# EAGLE design raspiPowerControl (EAGLE 9.6.2)

## Sheet 1 of 2: Raspberry Pi Power Switch with 5V micro USB socket
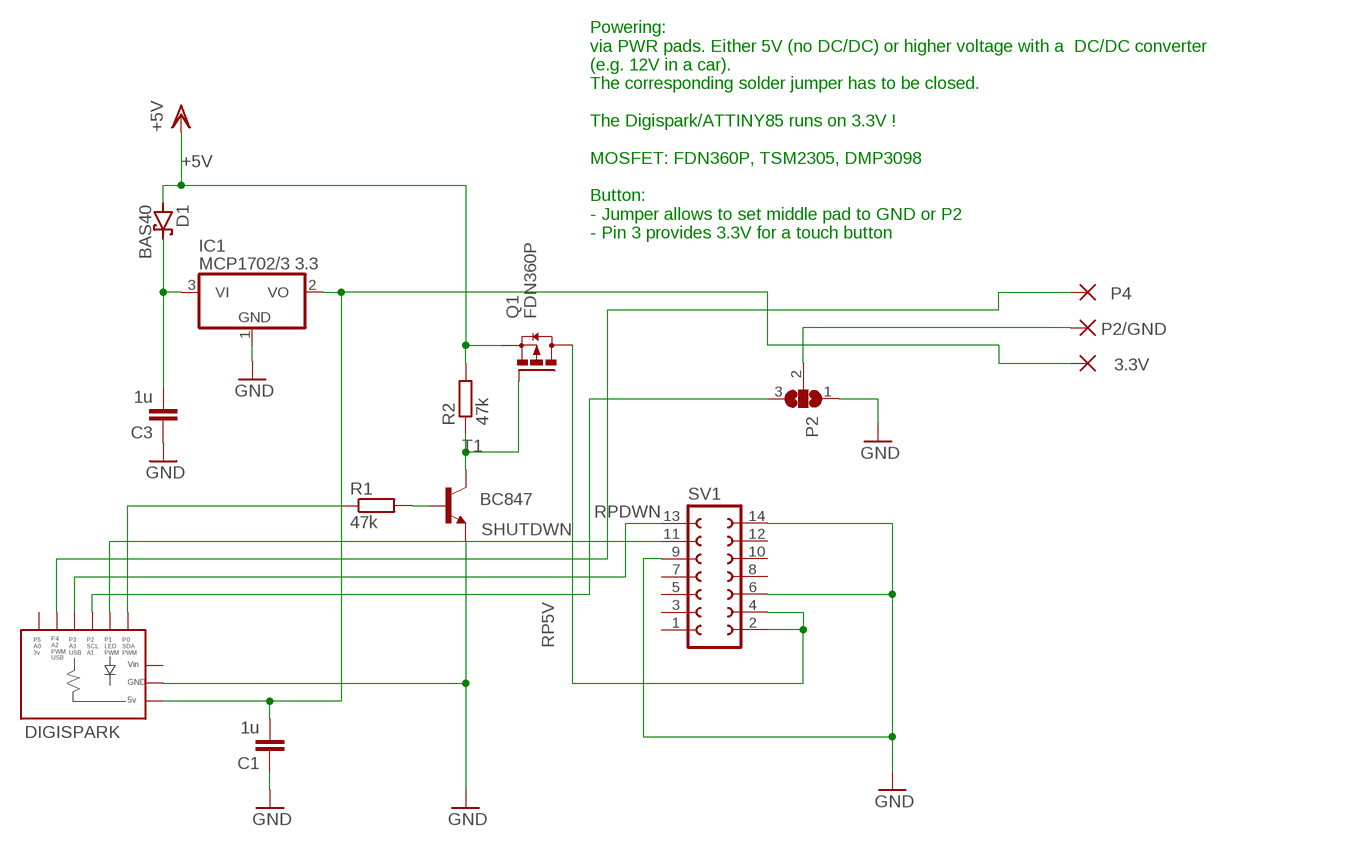
[diagram p0: schematic, sheet 1]

### Parts
3.3V  WIREPADSMD5-1,8  [5-1,8]
C1  1u  C-EUC0805  [C0805]
C3  1u  C-EUC0805  [C0805]
D1  BAS40  [SOT23]
DIGISPARK  DIGISPARKDIGISPARK-SMD  [DIGISPARK-SMD]
IC1  MCP1702/3 3.3  MCP1703CB  [SOT23]
P2  SJ2W  [SJ_2]
P2/GND  WIREPADSMD5-1,8  [5-1,8]
P4  WIREPADSMD5-1,8  [5-1,8]
Q1  FDN360P  [SUPER-SOT3]
R1  47k  R-EU_M0805  [M0805]
R2  47k  R-EU_M0805  [M0805]
SV1  FE07-2  [FE07-2]
T1  BC847  [SOT23]

### Nets
3V3: 3.3V.1(P) C1.2 DIGISPARK.5V IC1.2(VO)
+5V: D1.1(A) Q1.2(S) R2.2 ; also sheet 2
BUT2: P2.2 P2/GND.1(P)
BUT4: DIGISPARK.P4 P4.1(P)
GND: C1.1 C3.1 DIGISPARK.GND IC1.1(GND) P2.1 SV1.6 SV1.9 SV1.14 T1.2(E) ; also sheet 2
N$1: C3.2 D1.3(C) IC1.3(VI)
N$3: Q1.1(G) R2.1 T1.3(C)
N$4: R1.2 T1.1(B)
P2: DIGISPARK.P2 P2.3
RP5V: Q1.3(D) SV1.2 SV1.4
RPDWN: DIGISPARK.P3 SV1.13
SHUTDWN: DIGISPARK.P1 SV1.11
SWPWR: DIGISPARK.P0 R1.1
Unconnected: DIGISPARK.P5 SV1.1 SV1.3 SV1.5 SV1.7 SV1.8 SV1.10 SV1.12

### Notes on the sheet
- Powering:
  via PWR pads. Either 5V (no DC/DC) or higher voltage with a  DC/DC converter
  (e.g. 12V in a car). 
  The corresponding solder jumper has to be closed.
  
  The Digispark/ATTINY85 runs on 3.3V !
  
  MOSFET: FDN360P, TSM2305, DMP3098
  
  Button:
  - Jumper allows to set middle pad to GND or P2
  - Pin 3 provides 3.3V for a touch button

## Sheet 2 of 2: Addition for 12V car battery powering
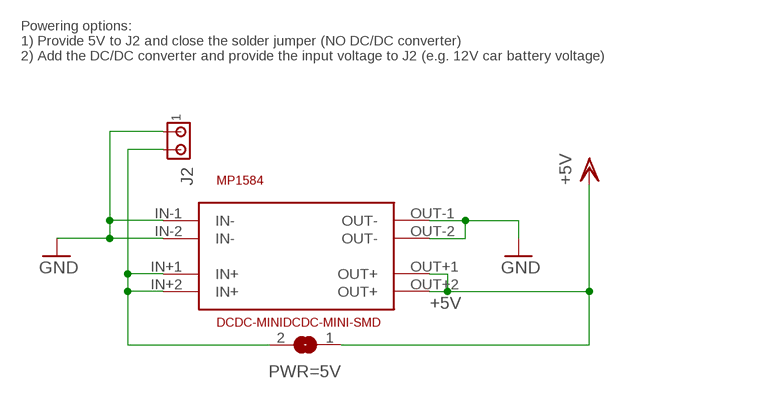
[diagram p1: schematic, sheet 2]

### Parts
J2  MTA02-100  [10X02MTA]
MP1584  DCDC-MINIDCDC-MINI-SMD  [DCDC-MINI-SMD]
PWR=5V  SJ  [SJ]

### Nets
+5V: MP1584.OUT+1(OUT+) MP1584.OUT+2(OUT+) PWR=5V.1 ; also sheet 1
GND: J2.1 MP1584.IN-1(IN-) MP1584.IN-2(IN-) MP1584.OUT-1(OUT-) MP1584.OUT-2(OUT-) ; also sheet 1
PWR: J2.2 MP1584.IN+1(IN+) MP1584.IN+2(IN+) PWR=5V.2

### Notes on the sheet
- Powering options:
  1) Provide 5V to J2 and close the solder jumper (NO DC/DC converter)
  2) Add the DC/DC converter and provide the input voltage to J2 (e.g. 12V car battery voltage)

## Power pins joined to a net without a drawn wire
VIN: DIGISPARK.VIN

## Library data of the parts
3.3V P2/GND P4 = wirepad:WIREPAD: Wire PAD connect wire on PCB
C1 C3 = rcl:C-EU: CAPACITOR, European symbol; SPICEPREFIX: C
D1 = diode:BAS40: Silicon Schottky Diodes General-purpose diode for high-speed switching
DIGISPARK = raspiPowerControl:DIGISPARK: Digispark http://digistump.com/wiki/digispark
IC1 = linear:MCP1703: 250 mA, 16V, Low Quiescent Current LDO Regulator Source: http://ww1.microchip.com/downloads/en/DeviceDoc/22049b.pdf
J2 = con-amp:MTA02-100: AMP connector
MP1584 = raspiPowerControl:DCDC-MINI: DC/DC Step-Down Converter 0.8-20V
P2 = jumper:SJ2W: SMD solder JUMPER
PWR=5V = jumper:SJ: SMD solder JUMPER
Q1 = transistor-power:FDN360P: Single P-Channel, PowerTrench (R) MOSFET Source: http://www.fairchildsemi.com/ds/FD/FDN360P.pdf
R1 R2 = rcl:R-EU_: RESISTOR, European symbol; SPICEPREFIX: R
SV1 = con-lsta:FE07-2: FEMALE HEADER; OC_FARNELL: unknown; OC_NEWARK: unknown
T1 = transistor-neu-to92:BC847: NPN TRANSISTOR

## Board
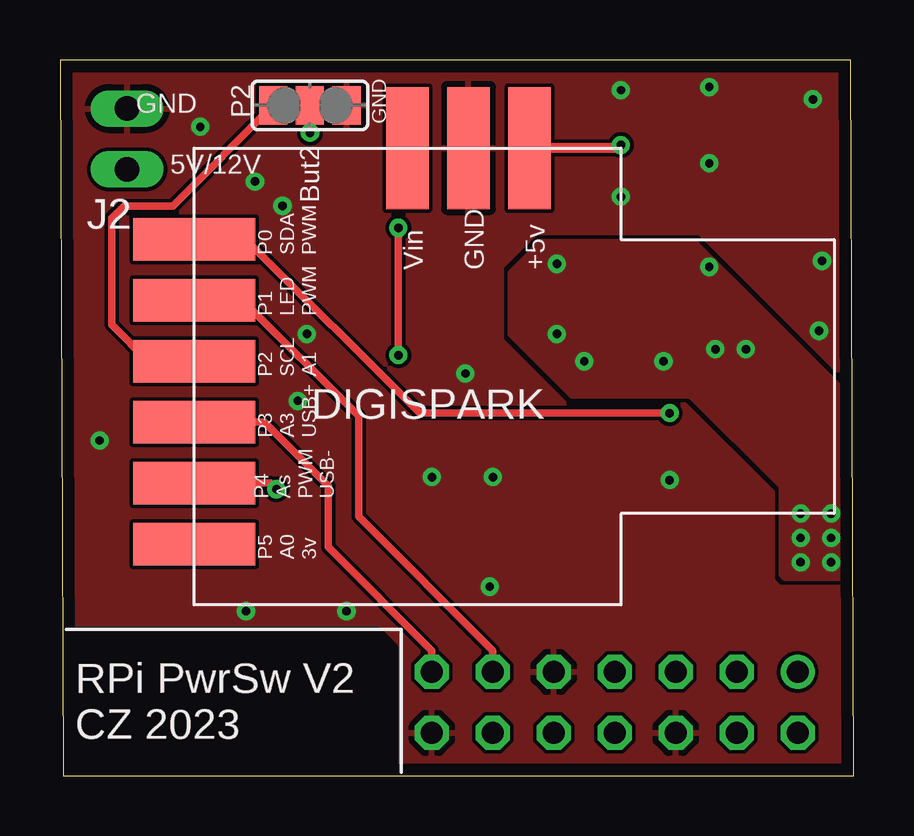
[diagram p2: board, top side]
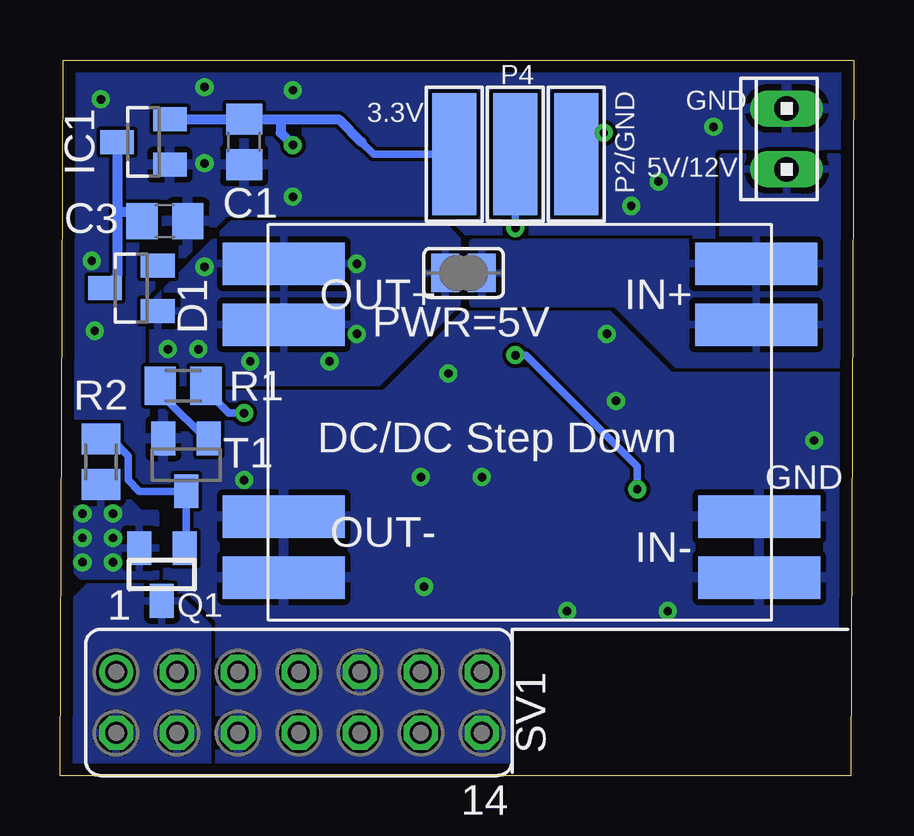
[diagram p3: board, bottom side, seen from below]

Size 33.07 x 29.84 mm. Coordinates in mm from the lower left corner, seen from the top.
Outline: 0.13,0 33.07,0 32.94,29.84 0,29.84 0.13,0
Copper layers (1*16): Top 0.035mm / dielectric 1.5mm / Bottom 0.035mm
Design rules "default *": minimum track width 6mil, minimum drill 0.35mm, track to track 6mil, track to pad 6mil, pad to pad 6mil, via to via 6mil, smd to smd 6mil, copper to edge 20mil, drill to drill 6mil, minimum pad ring 10mil, minimum via ring 8mil, stop-mask expansion 4mil, vias tented up to drill 0mil, thermal gap 10mil

### Footprints (pad centres in the part's own frame; a part is rotated, then mirrored left to right if it is on the bottom)
5-1,8 = smd 1.829 x 5.08: 1 0,0
C0805 = smd 1.3 x 1.5: 1 -0.95,0; 2 0.95,0
SOT23 = smd 1 x 1.4: 1 -0.95,-1.1; 2 0.95,-1.1; 3 0,1.1
DIGISPARK-SMD = smd 5.08 x 1.778: 5V 19.05,3.81; GND 19.05,6.35; VIN 19.05,8.89 | smd 1.778 x 5.08: P0 15.24,17.78; P1 12.7,17.78; P2 10.16,17.78; P3 7.62,17.78; P4 5.08,17.78; P5 2.54,17.78
10X02MTA = drill 1.016 long: 1 1.27,0; 2 -1.27,0
DCDC-MINI-SMD = smd 5.08 x 1.778: IN+1 -9.525,-7.239; IN+2 -9.525,-9.779; IN-1 -9.652,3.302; IN-2 -9.652,0.762; OUT+1 10.16,-7.239; OUT+2 10.16,-9.779; OUT-1 10.16,3.302; OUT-2 10.16,0.762
SJ_2 = smd 1.168 x 1.6: 1 -1.524,0; 2 0,0; 3 1.524,0
SJ = smd 1.168 x 1.6: 1 -0.762,0; 2 0.762,0
SUPER-SOT3 = smd 1 x 1.4: 1 -0.95,-1.1; 2 0.95,-1.1; 3 0,1.1
M0805 = smd 1.3 x 1.6: 1 -0.95,0; 2 0.95,0
FE07-2 = drill 0.914: 1 -7.62,1.27 | drill 0.914 octagon: 2 -7.62,-1.27; 3 -5.08,1.27; 4 -5.08,-1.27; 5 -2.54,1.27; 6 -2.54,-1.27; 7 0,1.27; 8 0,-1.27; 9 2.54,1.27; 10 2.54,-1.27; 11 5.08,1.27; 12 5.08,-1.27; 13 7.62,1.27; 14 7.62,-1.27

### Placement (x,y rotation side)
3.3V  16.64,25.91 0 bottom
C1  25.4,26.42 90 bottom
C3  28.7,23.11 180 bottom
D1  30.1,20.32 90 bottom
DIGISPARK  23.37,7.11 90 top
IC1  29.59,26.42 90 bottom
J2  2.79,26.54 90 bottom
MP1584  13.59,11.56 180 bottom
P2  10.41,27.94 180 top
P2/GND  11.56,25.91 0 bottom
P4  14.1,25.91 0 bottom
PWR=5V  16.26,20.95 0 bottom
Q1  28.83,8.38 180 bottom
R1  27.94,16.26 180 bottom
R2  31.37,13.08 270 bottom
SV1  23.11,3.05 0 bottom
T1  27.81,12.95 180 bottom

### Tracks (layer width: path | path; a pad name or v marks a point on that pad's centre or on a via)
3V3  (via drill 0.35)
  Top 0.406: v23.37,26.29 23.24,26.16 DIGISPARK.5V
  Bottom 0.305: 20.51,26.41 20,25.91 3.3V.1
  Bottom 0.406: IC1.2 C1.2 23.88,27.37 | 23.88,27.37 21.46,27.37 20.51,26.41 | 23.88,27.37 23.88,26.8 v23.37,26.29
+5V  (via drill 0.35)
  other vias: 27.05,21.21 28.57,17.78 27.3,17.78 21.84,17.27 25.15,17.27 20.7,18.41 20.7,21.34 30.86,10.92 32.13,10.92 32.13,9.91 32.13,8.89 30.86,8.89 30.86,9.91
  pour Bottom (rank 2): 16.51,22.35 16.51,19.68 19.81,16.38 29.21,16.38 29.21,19.68 25.91,22.99 17.14,22.99
  pour Top: 18.8,20.95 18.8,18.41 21.34,15.88 26.29,15.88 30.1,12.06 30.1,8.38 30.23,8.26 32.64,8.26 32.77,8.38 32.77,15.88 26.42,22.23 20.07,22.23
  pour Bottom (rank 2): 29.08,10.92 29.08,8.26 32.13,8.26 32.89,9.02 32.89,11.05 31.5,12.45 31.24,12.45 29.72,10.92
BUT2  (via drill 0.35)
  Top 0.305: P2.2 v10.41,26.8
  Bottom 0.305: v10.41,26.8 10.67,26.8 P2/GND.1
BUT4  (via drill 0.35)
  Top 0.305: DIGISPARK.P4 8.76,12.19 v9.02,11.94 | v14.1,17.53 v14.1,22.84
  Bottom 0.305: v14.1,17.53 13.67,17.53 9.02,12.88 v9.02,11.94 | v14.1,22.84 P4.1
GND  (via drill 0.35)
  other vias: 23.37,24.13 31.37,28.19 31.75,21.46 11.94,6.86 7.75,6.86 1.65,13.97 15.49,12.45 16.89,16.76 5.84,27.05 8.13,24.77 9.27,23.75 17.91,7.87 10.29,18.41 9.91,15.62 27.05,25.53 27.05,28.7 23.37,28.57 25.4,12.32 31.62,18.54 18.03,12.45
  pour Top (rank 3): 0.13,29.46 0.13,6.35 13.34,6.35 14.22,5.46 14.22,0 32.77,0 32.77,29.46
  pour Bottom (rank 3): 13.84,6.35 0.63,6.35 0.13,6.86 0.13,29.59 32.77,29.59 32.77,0 21.21,0 21.21,0 14.35,0 14.35,6.1 14.1,6.35
N$1
  Bottom 0.406: IC1.3 30.69,23.5 | 30.69,23.5 30.69,20.83 D1.3 | C3.2 30.03,23.5 30.69,23.5
N$3
  Bottom 0.305: R2.1 30.92,14.03 30.23,13.34 30.23,12.32 29.76,11.85 T1.3 27.81,9.55 Q1.1
N$4
  Bottom 0.305: R1.2 28.55,15.82 28.64,15.68 27.01,14.05 T1.1
P2
  Top 0.305: 9.02,27.81 P2.3 4.7,23.75 2.67,23.75 2.16,23.24 2.16,18.8 3.68,17.27 DIGISPARK.P2
PWR
  pour Bottom: 0.64,25.78 0.64,17.14 7.37,17.14 9.91,19.68 15.88,19.68 15.88,22.23 5.46,22.23 5.46,25.78
RP5V
  pour Bottom: 28.57,7.87 31.88,7.87 32.77,6.99 32.77,0.64 32.13,0 27.05,0 26.92,0.13 26.92,6.22
RPDWN
  Top 0.305: DIGISPARK.P3 8.51,14.73 11.18,12.06 11.18,9.53 15.49,5.21 SV1.13
SHUTDWN
  Top 0.305: DIGISPARK.P1 7.62,19.81 12.45,14.99 12.45,10.79 18.03,5.21 SV1.11
SWPWR  (via drill 0.35)
  Top 0.305: 5.46,22.23 DIGISPARK.P0 7.75,22.35 14.99,15.11 v25.4,15.11
  Bottom 0.305: v25.4,15.11 26.04,15.11 26.8,15.88 26.84,16.32 R1.1

### Text on the board
tPlace: GND | GND | 5V/12V | But2
bPlace: GND | 5V/12V | GND
tNames: RPi PwrSw V2 / CZ 2023
bNames: Q1